# EAGLE design Busboard expand v12 (EAGLE 8.5.2)
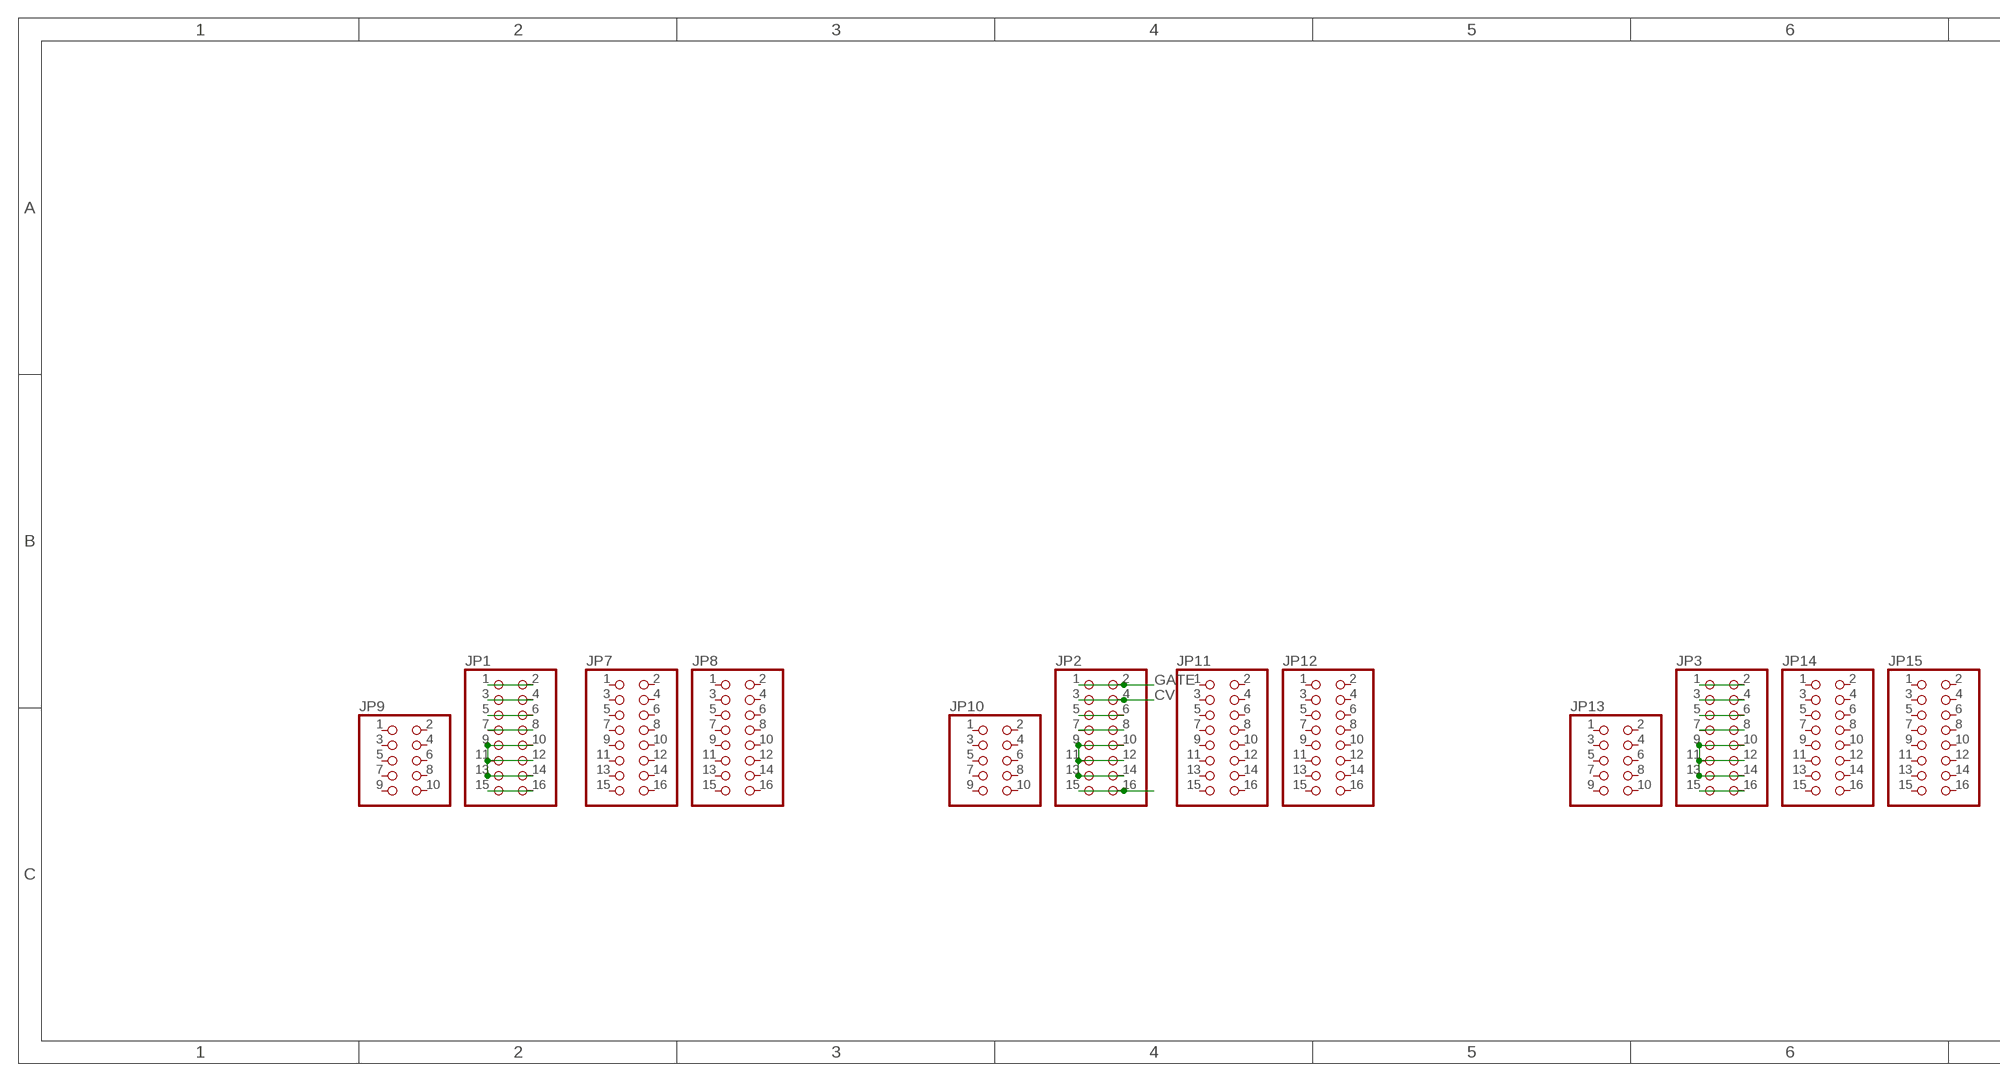
[diagram p0: schematic, sheet 1, part 1 of 2]
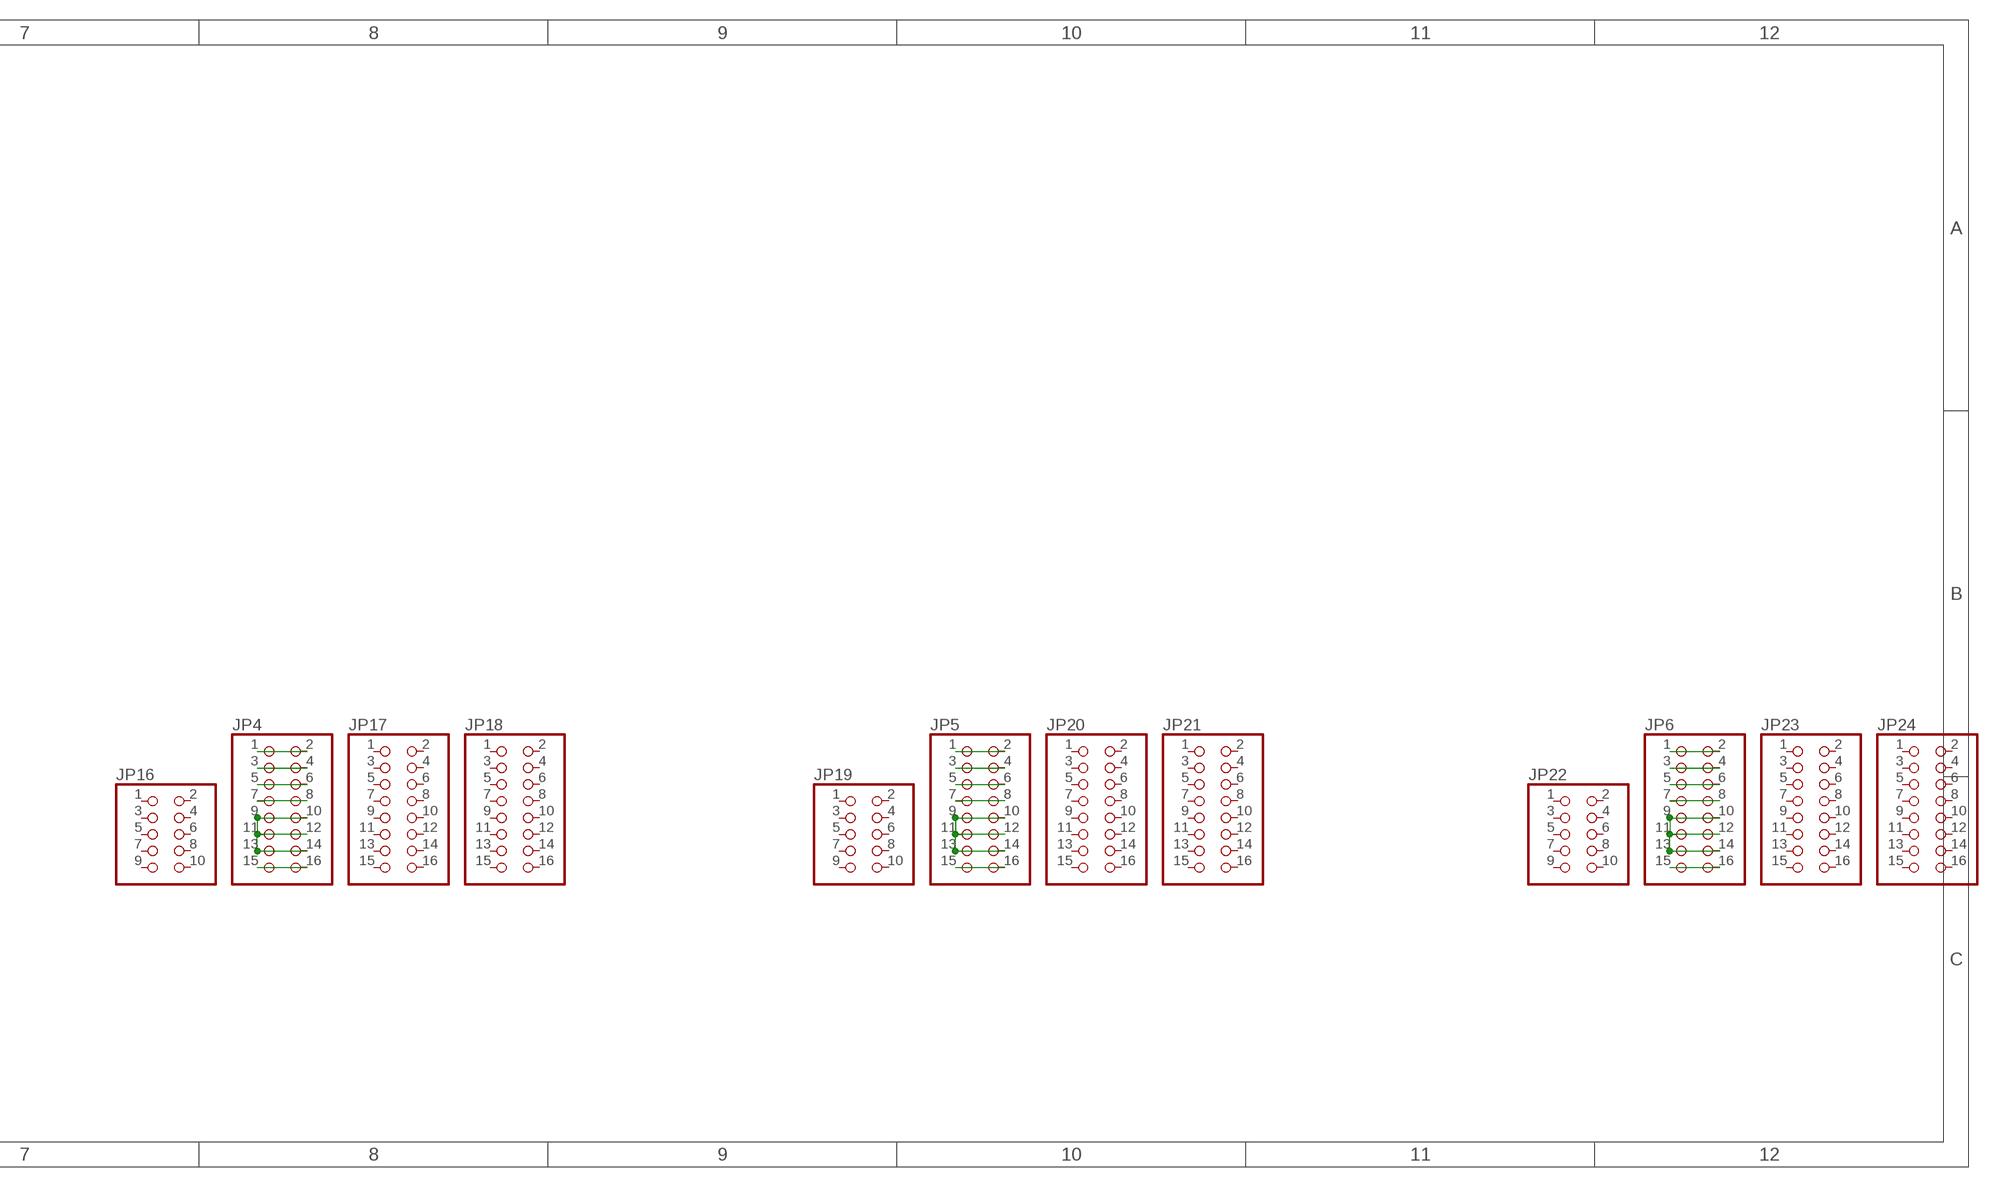
[diagram p1: schematic, sheet 1, part 2 of 2]

## Parts
JP1  PINHD-2X8  [2X08]
JP2  PINHD-2X8  [2X08]
JP3  PINHD-2X8  [2X08]
JP4  PINHD-2X8  [2X08]
JP5  PINHD-2X8  [2X08]
JP6  PINHD-2X8  [2X08]
JP7  PINHD-2X8/90  [2X08/90]
JP8  PINHD-2X8/90  [2X08/90]
JP9  PINHD-2X5  [2X05]
JP10  PINHD-2X5  [2X05]
JP11  PINHD-2X8/90  [2X08/90]
JP12  PINHD-2X8/90  [2X08/90]
JP13  PINHD-2X5  [2X05]
JP14  PINHD-2X8/90  [2X08/90]
JP15  PINHD-2X8/90  [2X08/90]
JP16  PINHD-2X5  [2X05]
JP17  PINHD-2X8/90  [2X08/90]
JP18  PINHD-2X8/90  [2X08/90]
JP19  PINHD-2X5  [2X05]
JP20  PINHD-2X8/90  [2X08/90]
JP21  PINHD-2X8/90  [2X08/90]
JP22  PINHD-2X5  [2X05]
JP23  PINHD-2X8/90  [2X08/90]
JP24  PINHD-2X8/90  [2X08/90]

## Nets
CV: JP1.3 JP1.4 JP2.3 JP2.4 JP3.3 JP3.4 JP4.3 JP4.4 JP5.3 JP5.4 JP6.3 JP6.4
GATE: JP1.1 JP1.2 JP2.1 JP2.2 JP3.1 JP3.2 JP4.1 JP4.2 JP5.1 JP5.2 JP6.1 JP6.2
N$1: JP2.9 JP2.10 JP2.11 JP2.12 JP2.13 JP2.14
N$2: JP3.9 JP3.10 JP3.11 JP3.12 JP3.13 JP3.14
N$3: JP1.9 JP1.10 JP1.11 JP1.12 JP1.13 JP1.14
N$4: JP3.15 JP3.16
N$5: JP4.9 JP4.10 JP4.11 JP4.12 JP4.13 JP4.14
N$6: JP1.15 JP1.16
N$7: JP5.9 JP5.10 JP5.11 JP5.12 JP5.13 JP5.14
N$8: JP1.7 JP1.8
N$9: JP4.15 JP4.16
N$10: JP6.9 JP6.10 JP6.11 JP6.12 JP6.13 JP6.14
N$14: JP6.15 JP6.16
N$16: JP6.7 JP6.8
N$19: JP2.15 JP2.16
N$20: JP2.5 JP2.6
N$21: JP1.5 JP1.6
N$23: JP2.7 JP2.8
N$27: JP3.5 JP3.6
N$31: JP5.15 JP5.16
N$32: JP5.7 JP5.8
N$33: JP3.7 JP3.8
N$35: JP4.7 JP4.8
N$51: JP4.5 JP4.6
N$60: JP5.5 JP5.6
N$67: JP6.5 JP6.6
Unconnected: JP7.1 JP7.2 JP7.3 JP7.4 JP7.5 JP7.6 JP7.7 JP7.8 JP7.9 JP7.10 JP7.11 JP7.12 JP7.13 JP7.14 JP7.15 JP7.16 JP8.1 JP8.2 JP8.3 JP8.4 JP8.5 JP8.6 JP8.7 JP8.8 JP8.9 JP8.10 JP8.11 JP8.12 JP8.13 JP8.14 JP8.15 JP8.16 JP9.1 JP9.2 JP9.3 JP9.4 JP9.5 JP9.6 JP9.7 JP9.8 JP9.9 JP9.10 JP10.1 JP10.2 JP10.3 JP10.4 JP10.5 JP10.6 JP10.7 JP10.8 JP10.9 JP10.10 JP11.1 JP11.2 JP11.3 JP11.4 JP11.5 JP11.6 JP11.7 JP11.8 JP11.9 JP11.10 JP11.11 JP11.12 JP11.13 JP11.14 JP11.15 JP11.16 JP12.1 JP12.2 JP12.3 JP12.4 JP12.5 JP12.6 JP12.7 JP12.8 JP12.9 JP12.10 JP12.11 JP12.12 JP12.13 JP12.14 JP12.15 JP12.16 JP13.1 JP13.2 JP13.3 JP13.4 JP13.5 JP13.6 JP13.7 JP13.8 JP13.9 JP13.10 JP14.1 JP14.2 JP14.3 JP14.4 JP14.5 JP14.6 JP14.7 JP14.8 JP14.9 JP14.10 JP14.11 JP14.12 JP14.13 JP14.14 JP14.15 JP14.16 JP15.1 JP15.2 JP15.3 JP15.4 JP15.5 JP15.6 JP15.7 JP15.8 JP15.9 JP15.10 JP15.11 JP15.12 JP15.13 JP15.14 JP15.15 JP15.16 JP16.1 JP16.2 JP16.3 JP16.4 JP16.5 JP16.6 JP16.7 JP16.8 JP16.9 JP16.10 JP17.1 JP17.2 JP17.3 JP17.4 JP17.5 JP17.6 JP17.7 JP17.8 JP17.9 JP17.10 JP17.11 JP17.12 JP17.13 JP17.14 JP17.15 JP17.16 JP18.1 JP18.2 JP18.3 JP18.4 JP18.5 JP18.6 JP18.7 JP18.8 JP18.9 JP18.10 JP18.11 JP18.12 JP18.13 JP18.14 JP18.15 JP18.16 JP19.1 JP19.2 JP19.3 JP19.4 JP19.5 JP19.6 JP19.7 JP19.8 JP19.9 JP19.10 JP20.1 JP20.2 JP20.3 JP20.4 JP20.5 JP20.6 JP20.7 JP20.8 JP20.9 JP20.10 JP20.11 JP20.12 JP20.13 JP20.14 JP20.15 JP20.16 JP21.1 JP21.2 JP21.3 JP21.4 JP21.5 JP21.6 JP21.7 JP21.8 JP21.9 JP21.10 JP21.11 JP21.12 JP21.13 JP21.14 JP21.15 JP21.16 JP22.1 JP22.2 JP22.3 JP22.4 JP22.5 JP22.6 JP22.7 JP22.8 JP22.9 JP22.10 JP23.1 JP23.2 JP23.3 JP23.4 JP23.5 JP23.6 JP23.7 JP23.8 JP23.9 JP23.10 JP23.11 JP23.12 JP23.13 JP23.14 JP23.15 JP23.16 JP24.1 JP24.2 JP24.3 JP24.4 JP24.5 JP24.6 JP24.7 JP24.8 JP24.9 JP24.10 JP24.11 JP24.12 JP24.13 JP24.14 JP24.15 JP24.16

## Library data of the parts
JP1-JP8 JP11 JP12 JP14 JP15 JP17 JP18 JP20 JP21 JP23 JP24 = pinhead:PINHD-2X8: PIN HEADER
JP9 JP10 JP13 JP16 JP19 JP22 = pinhead:PINHD-2X5: PIN HEADER

## Board
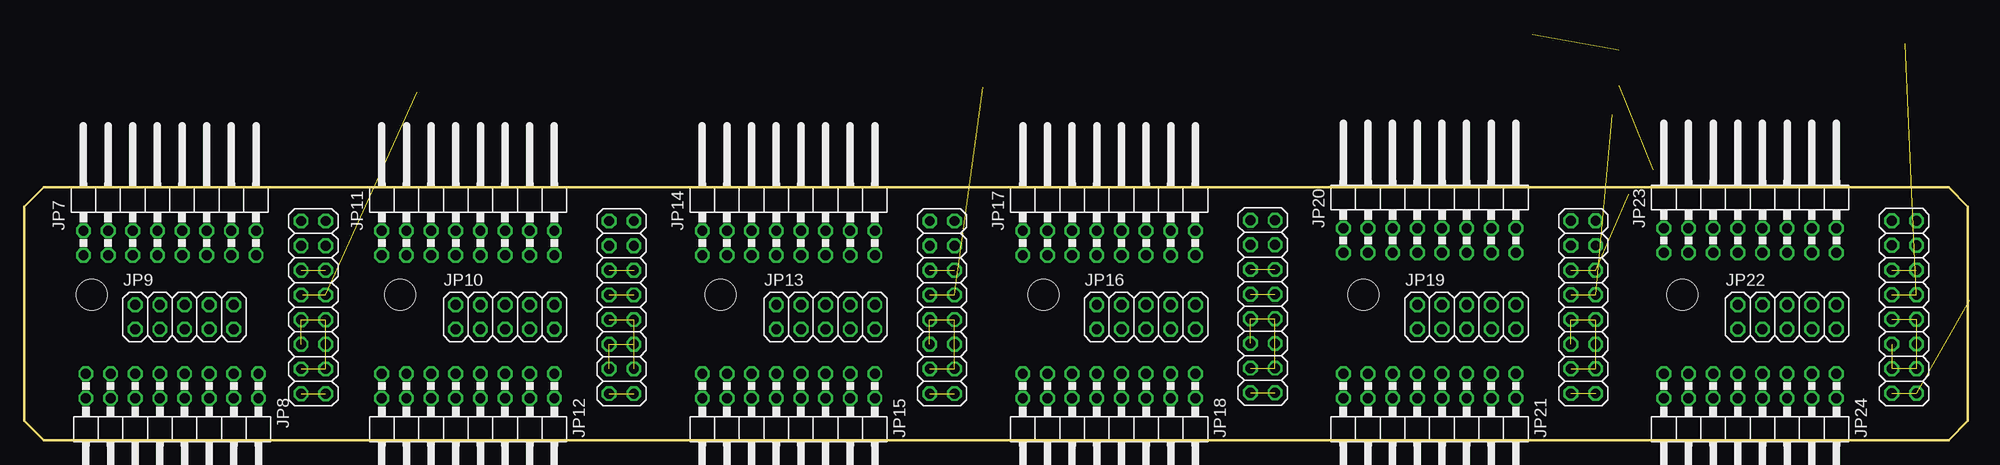
[diagram p2: board, top side]
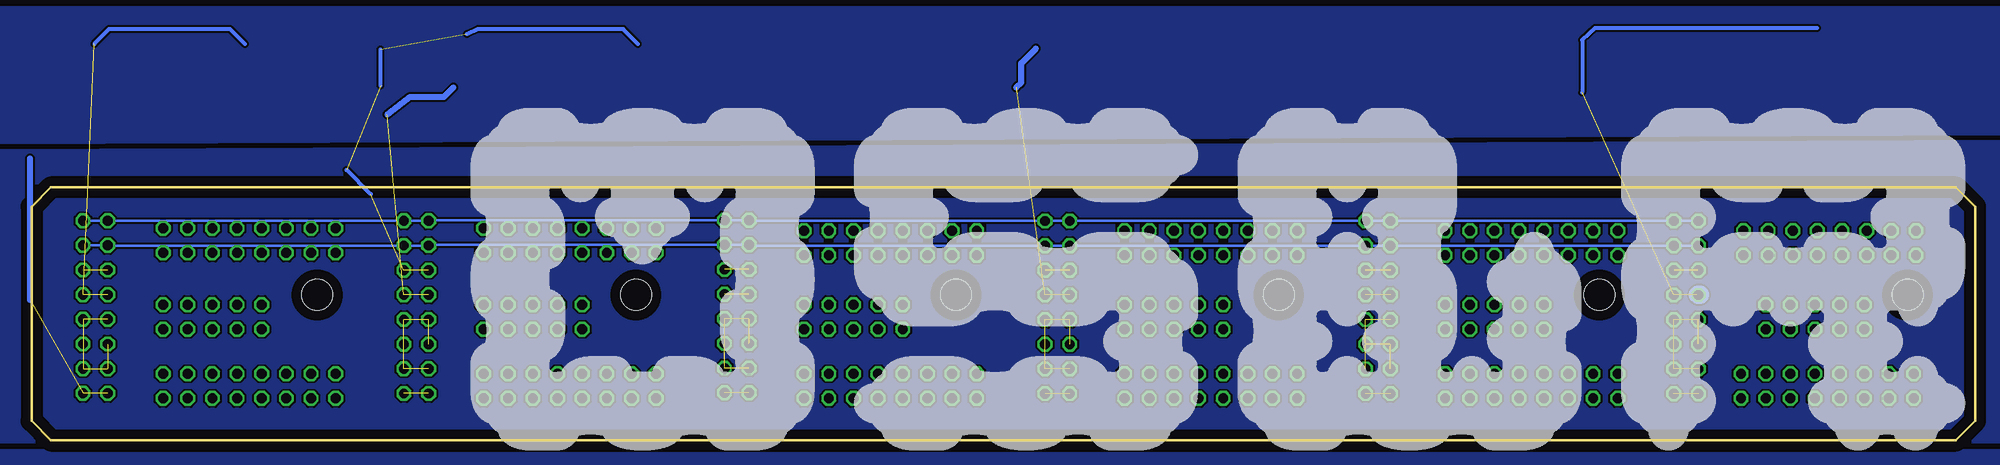
[diagram p3: board, bottom side, seen from below]

Size 200.24 x 26.06 mm. Coordinates in mm from the lower left corner, seen from the top.
Outline: 0,24.06 2,26.06 198.24,26.06 200.24,24.06 200.24,2 198.24,0 2,0 0,2 0,24.06
Copper layers (1*16): Top 0.035mm / dielectric 1.5mm / Bottom 0.035mm
Design rules "default": minimum track width 10mil, minimum drill 24mil, track to track 8mil, track to pad 8mil, pad to pad 8mil, via to via 8mil, smd to smd 8mil, copper to edge 40mil, drill to drill 8mil, minimum pad ring 10mil, minimum via ring 8mil, stop-mask expansion 4mil, vias tented up to drill 0mil, thermal gap 10mil
Holes 3.2 mm at 71.75,14.97 105,14.97 137.98,14.97 38.73,14.97 170.81,14.97 6.97,14.97

### Footprints (pad centres in the part's own frame; a part is rotated, then mirrored left to right if it is on the bottom)
2X08 = drill 1.016 octagon: 1 -8.89,-1.27; 2 -8.89,1.27; 3 -6.35,-1.27; 4 -6.35,1.27; 5 -3.81,-1.27; 6 -3.81,1.27; 7 -1.27,-1.27; 8 -1.27,1.27; 9 1.27,-1.27; 10 1.27,1.27; 11 3.81,-1.27; 12 3.81,1.27; 13 6.35,-1.27; 14 6.35,1.27; 15 8.89,-1.27; 16 8.89,1.27
2X08/90 = drill 1.016 octagon: 1 -8.89,-6.35; 2 -8.89,-3.81; 3 -6.35,-6.35; 4 -6.35,-3.81; 5 -3.81,-6.35; 6 -3.81,-3.81; 7 -1.27,-6.35; 8 -1.27,-3.81; 9 1.27,-6.35; 10 1.27,-3.81; 11 3.81,-6.35; 12 3.81,-3.81; 13 6.35,-6.35; 14 6.35,-3.81; 15 8.89,-6.35; 16 8.89,-3.81
2X05 = drill 1.016 octagon: 1 -5.08,-1.27; 2 -5.08,1.27; 3 -2.54,-1.27; 4 -2.54,1.27; 5 0,-1.27; 6 0,1.27; 7 2.54,-1.27; 8 2.54,1.27; 9 5.08,-1.27; 10 5.08,1.27

### Placement (x,y rotation side)
JP1  29.78,13.7 270 top
JP2  61.53,13.7 270 top
JP3  94.55,13.7 270 top
JP4  127.59,13.78 270 top
JP5  160.61,13.71 270 top
JP6  193.67,13.72 270 top
JP7  14.99,25.4 0 top
JP8  15.24,0.51 180 top
JP9  16.51,12.7 0 top
JP10  49.53,12.7 0 top
JP11  45.72,25.4 0 top
JP12  45.72,0.51 180 top
JP13  82.55,12.7 0 top
JP14  78.74,25.4 0 top
JP15  78.74,0.51 180 top
JP16  115.57,12.7 0 top
JP17  111.76,25.4 0 top
JP18  111.76,0.51 180 top
JP19  148.59,12.7 0 top
JP20  144.78,25.65 0 top
JP21  144.78,0.51 180 top
JP22  181.61,12.7 0 top
JP23  177.8,25.65 0 top
JP24  177.8,0.51 180 top

### Tracks (layer width: path | path; a pad name or v marks a point on that pad's centre or on a via)
15IN
  pour Bottom: -46.72,24.84 -27.73,24.73 -28.18,44.54 -46.72,44.84
+15V
  pour Bottom: -15.72,31.85 204.28,30.84 204.28,44.34 -15.72,44.34
-15IN
  pour Bottom: -46.72,4.84 -28.22,4.84 -28.22,-11.16 -46.72,-11.16
-15V
  pour Bottom: 204.28,-11.16 204.28,-1.16 -15.72,-1.16 -15.72,-11.16
CV
  Bottom 0.254: JP1.3 JP1.4 JP2.3 JP2.4 JP3.3 JP3.4 126.24,20.05 JP4.3 JP4.4 159.26,20.14 JP5.3 JP5.4 192.39,20.06 JP6.3 JP6.4
GATE
  Bottom 0.254: JP1.1 JP1.2 JP2.1 JP2.2 JP3.1 JP3.2 126.24,22.59 JP4.1 JP4.2 159.26,22.68 JP5.1 JP5.2 192.39,22.6 JP6.1 JP6.2
GND
  pour Bottom: -46.72,7.84 -9.72,7.84 -9.72,22.84 -46.72,22.84
  pour Bottom: -15.72,-0.16 204.28,-0.16 204.28,29.84 -15.72,30.84
N$1  (5 unrouted)
N$2  (5 unrouted)
N$3  (5 unrouted)
N$4  (1 unrouted)
N$5  (5 unrouted)
N$6  (1 unrouted)
N$7  (5 unrouted)
N$8  (2 unrouted)
  Bottom 0.406: 16.28,42.44 39.18,42.44 40.48,41.24 40.48,35.84
  Bottom 1.676: 28.38,15 28.67,15 28.68,15
  Bottom 1.93: JP1.7 28.38,14.96 28.38,15
N$9  (1 unrouted)
N$10  (5 unrouted)
N$14  (2 unrouted)
  Bottom 0.61: 200.38,14.44 200.38,29.04
N$16  (2 unrouted)
  Bottom 0.406: 193.78,40.84 192.28,42.34 179.78,42.34 178.28,40.84
N$19  (1 unrouted)
N$20  (1 unrouted)
N$21  (1 unrouted)
N$23  (1 unrouted)
N$27  (1 unrouted)
N$31  (1 unrouted)
N$32  (2 unrouted)
  Bottom 0.61: 163.58,33.54 161.28,35.34 157.78,35.34 156.78,36.34
N$33  (2 unrouted)
  Bottom 0.61: 96.78,40.34 98.28,38.84 98.28,36.84 98.78,36.34
N$35  (1 unrouted)
N$51  (1 unrouted)
N$60  (4 unrouted)
  Bottom 0.406: 164.28,36.54 164.28,40.24 | 165.28,25.34 167.78,27.84 | 155.38,41.84 154.28,42.34 139.28,42.34 137.78,40.84
N$67  (1 unrouted)

### Text on the board
bPlace: /Users/Bruno/Desktop/OSLR/PCB_Assets/22_bPlace.bmp
_tNames: F1 | C22 | C27 | C32 | C4 | C8 | C16 | C36 | U$1 | 7805 | C34 | GND | 7812 | C37 | 7912 | C35 | F2 | U$2 | C5 | C9 | C17 | C23 | C28 | C33